# Altium schematic sheet PA0960_IR_Dot_Projector_IR_Flood_LED.SchDoc: =project_title
size Tabloid; PageSetup: Record=PageOptions|CenterHorizontal=True|CenterVertical=True|PrintScale=0.73|XCorrection=1.00|YCorrection=1.00|PrintKind=0|BorderSize=5000000|LeftOffset=0|BottomOffset=0|Orientation=2|PaperLength=1000|PaperWidth=1000|Scale=100|PaperSource=7|PrintQuality=-4|MediaType=1|DitherType=10|PaperKind=A4|PrintScaleMode=1; CompanyName: Luxonis Holding; Organization: Luxonis Holding; Address1: 1925 Harmony Park Drive; Address2: Westminster, CO; Address3: 80234; Address4: United States; SheetNumber: 2; SheetTotal: 3
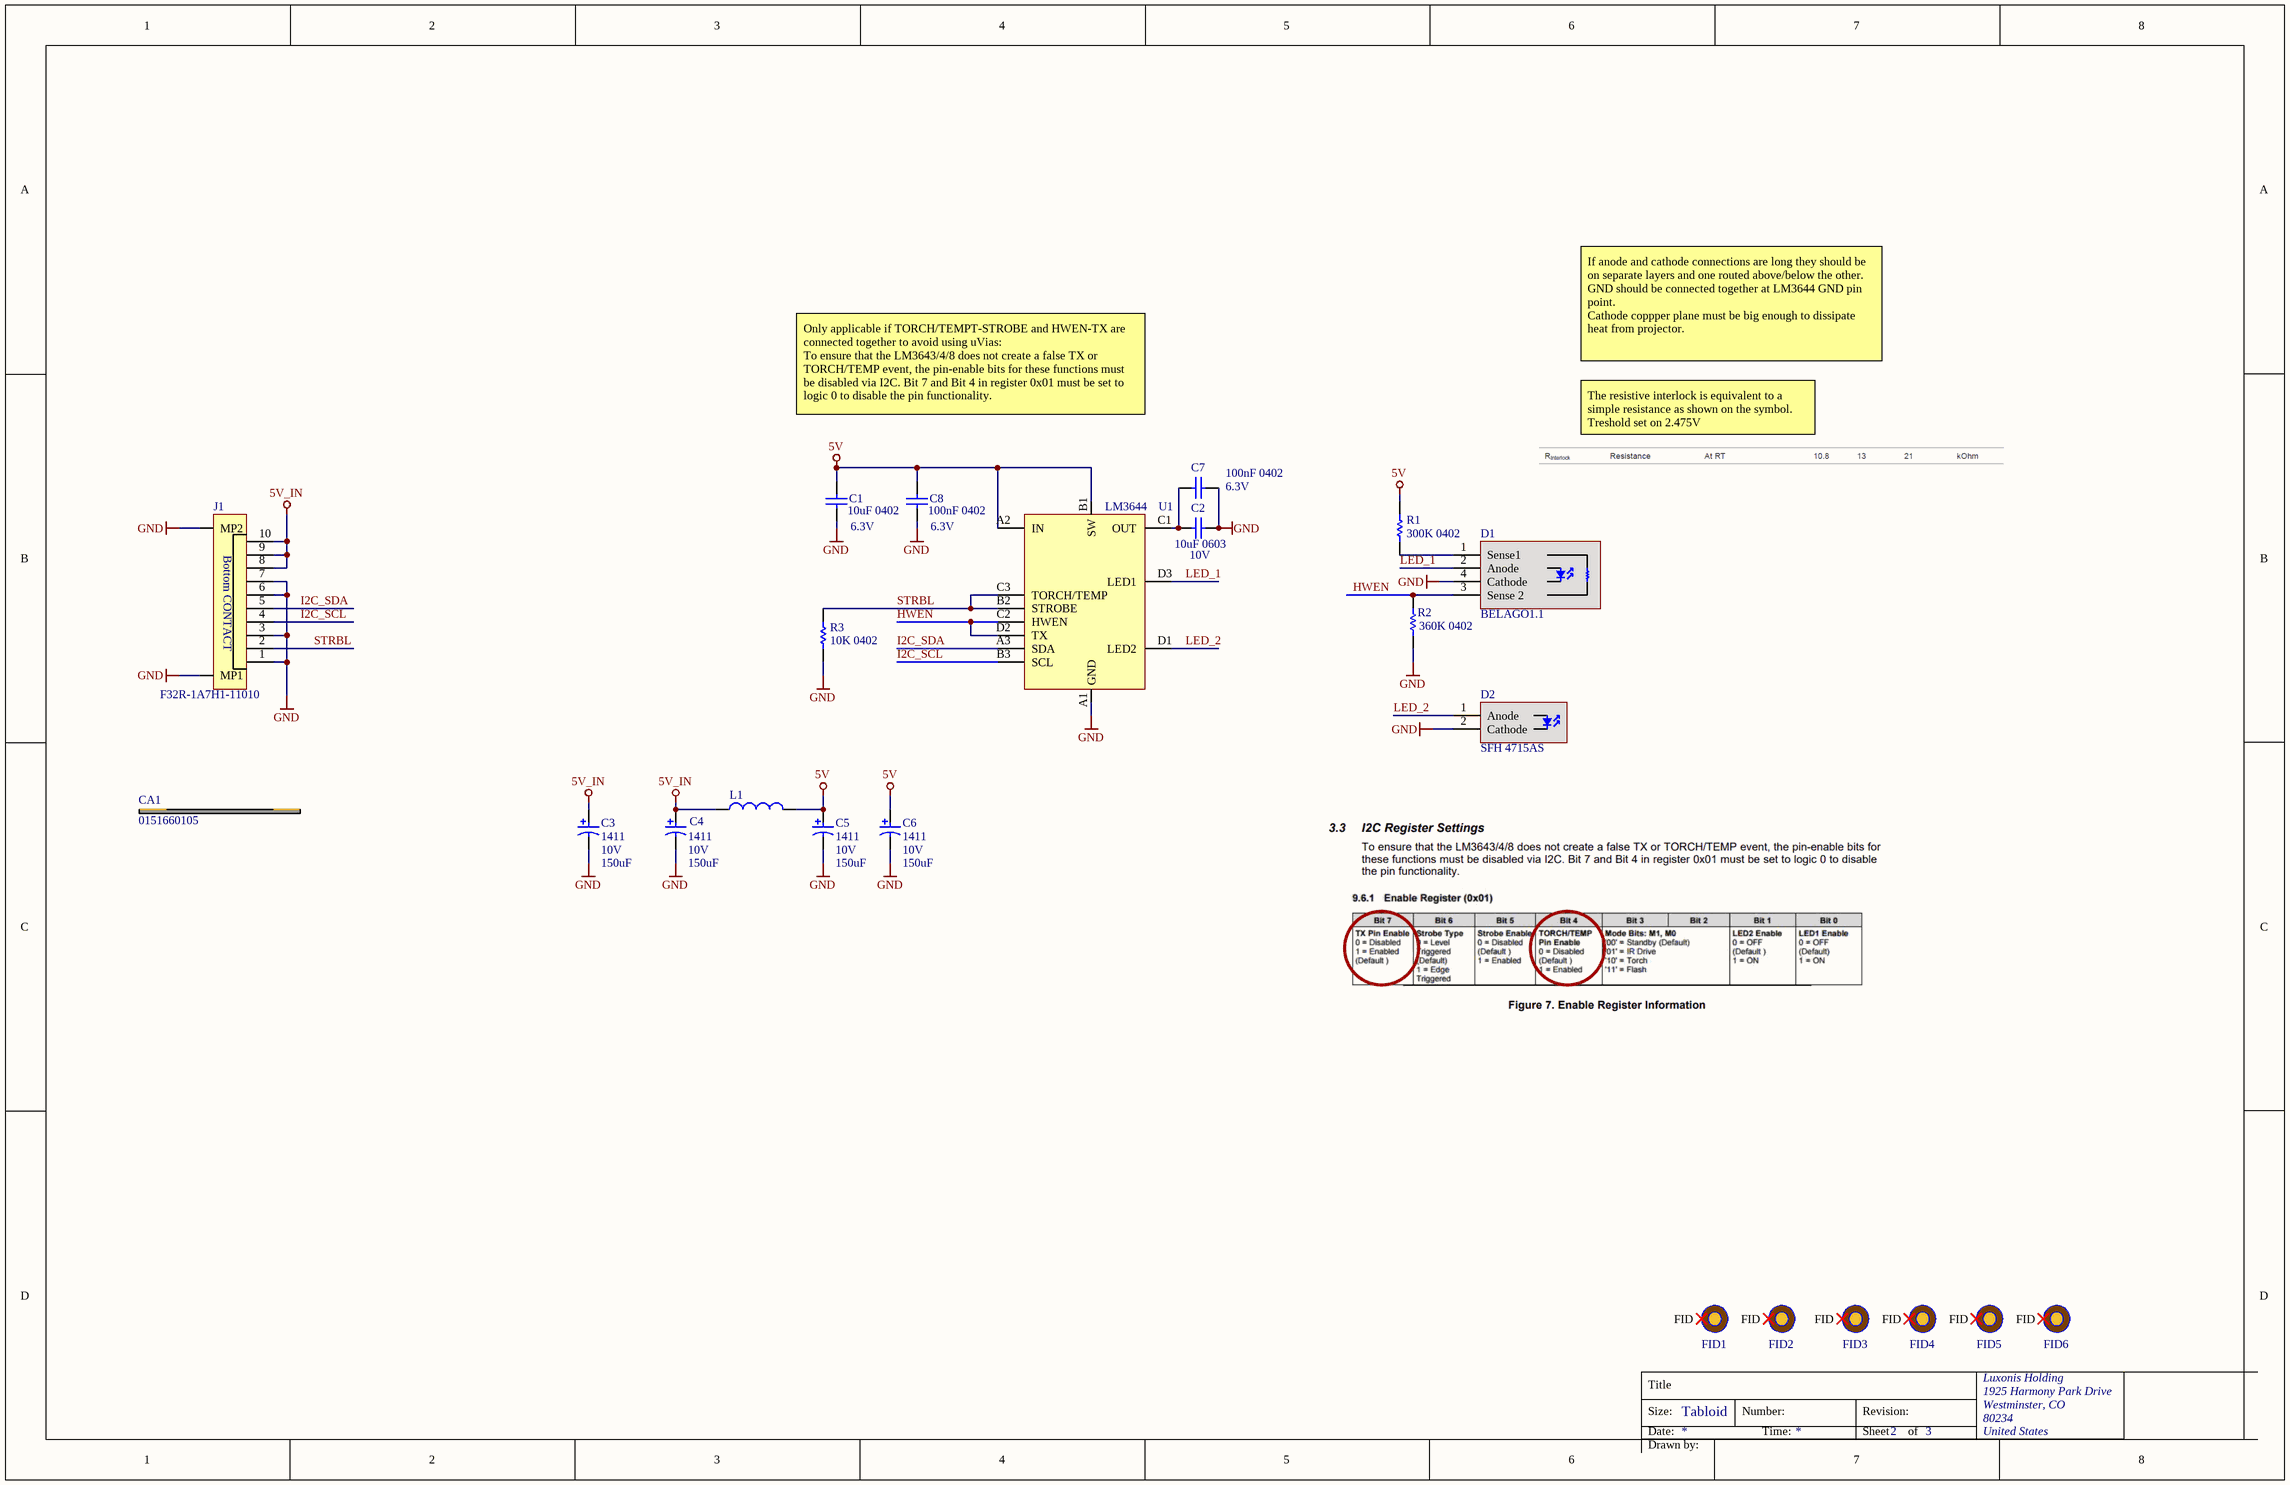
[diagram p0: PA0960_IR_Dot_Projector_IR_Flood_LED.SchDoc]

## Parts
C1  10uF 0402  Voltage Rating: 6.3V  [CAPC0402(1005)70_N]
C2  10uF 0603  Voltage Rating: 10V  [CAPC0603(1608)100_N]
C3  Size Code: 1411  Rated DC Voltage (URdc): 10V  Capacitance: 150uF  [RESTL1210(3225)_L]  (hidden comment: 150uF 1206 10V tantal)
C4  Size Code: 1411  Rated DC Voltage (URdc): 10V  Capacitance: 150uF  [RESTL1210(3225)_L]  (hidden comment: 150uF 1206 10V tantal)
C5  Size Code: 1411  Rated DC Voltage (URdc): 10V  Capacitance: 150uF  [RESTL1210(3225)_L]  (hidden comment: 150uF 1206 10V tantal)
C6  Size Code: 1411  Rated DC Voltage (URdc): 10V  Capacitance: 150uF  [RESTL1210(3225)_L]  (hidden comment: 150uF 1206 10V tantal)
C7  100nF 0402  Voltage Rating: 6.3V  [CAPC0402(1005)70_N]
C8  100nF 0402  Voltage Rating: 6.3V  [CAPC0402(1005)70_N]
CA1  0151660105
D1  BELAGO1.1  [Belago1.1]
D2  SFH 4715AS  [SFH 4715AS]
FID1  FIDUCIAL_ROUND_1MM  [FIDUCIAL_ROUND_1MM]  (value not drawn)  (no BOM)
FID2  FIDUCIAL_ROUND_1MM  [FIDUCIAL_ROUND_1MM]  (value not drawn)  (no BOM)
FID3  FIDUCIAL_ROUND_1MM  [FIDUCIAL_ROUND_1MM]  (value not drawn)  (no BOM)
FID4  FIDUCIAL_ROUND_1MM  [FIDUCIAL_ROUND_1MM]  (value not drawn)  (no BOM)
FID5  FIDUCIAL_ROUND_1MM  [FIDUCIAL_ROUND_1MM]  (value not drawn)  (no BOM)
FID6  FIDUCIAL_ROUND_1MM  [FIDUCIAL_ROUND_1MM]  (value not drawn)  (no BOM)
J1  F32R-1A7H1-11010  [F32R-1A7H1-11010]
L1  742792011  [SMD-0805]  (value not drawn)
R1  300K 0402  [RESC0402(1005)_L]
R2  360K 0402  [RESC0402(1005)_N]
R3  10K 0402  [RESC0402(1005)_L]
U1  LM3644  [LM3644YFFR]

## Nets
5V: C1.2 C5.1 C6.1 C8.2 L1.2 R1.2 U1.A2(IN) U1.B1(SW)
5V_IN: C3.1 C4.1 J1.8 J1.9 J1.10 L1.1
GND: C1.1 C2.2 C3.2 C4.2 C5.2 C6.2 C7.1 C8.1 D1.4(Cathode) D2.2(Cathode) J1.1 J1.3 J1.6 J1.7 J1.MP1 J1.MP2 R2.1 R3.1 U1.A1(GND)
HWEN: D1.3(Sense_2) R2.2 U1.C2(HWEN) U1.D2(TX)
I2C_SCL: J1.4 U1.B3(SCL)
I2C_SDA: J1.5 U1.A3(SDA)
LED_1: D1.2(Anode) U1.D3(LED1)
LED_2: D2.1(Anode) U1.D1(LED2)
STRBL: J1.2 R3.2 U1.B2(STROBE) U1.C3(TORCH/TEMP)
NetC2_1: C2.1 C7.2 U1.C1(OUT)
NetD1_1: D1.1(Sense1) R1.1

Not connected (* = marked no-connect by the designer): FID1 FID*; FID2 FID*; FID3 FID*; FID4 FID*; FID5 FID*; FID6 FID*

## Notes on the sheet
- If anode and cathode connections are long they should be on separate layers and one routed above/below the other.
  GND should be connected together at LM3644 GND pin point.
  Cathode coppper plane must be big enough to dissipate heat from projector.
- Only applicable if TORCH/TEMPT-STROBE and HWEN-TX are connected together to avoid using uVias:
  To ensure that the LM3643/4/8 does not create a false TX or TORCH/TEMP event, the pin-enable bits for these functions must be disabled via I2C. Bit 7 and Bit 4 in register 0x01 must be set to logic 0 to disable the pin functionality.
- The resistive interlock is equivalent to a simple resistance as shown on the symbol.
  Treshold set on 2.475V
- Title
- Size:
- Date:
- Tabloid
- Number:
- Time:
- Revision:
- Sheet
- of
- Drawn by:
- (in symbol CMP-002-00101-1) Bottom CONTACT

## Library data of the parts
C1 C7 C8 = CMP-004-000009-1: CAP CER 10UF 6.3V X5R 0402 20%; Manufacturer 1: Murata; Manufacturer Part Number 1: GRM155R60J106ME15D; Max Operating Temperature: 85°C; ComponentLink1Description: https://www.murata.com/~/media/webrenewal/support/library/catalog/products/capacitor/mlcc/c02e.ashx?la=en-us&src-supplier=Digi-Key; Design Item ID: GRM155R60J106ME15D; ComponentLink1URL: https://www.murata.com/~/media/webrenewal/support/library/catalog/products/capacitor/mlcc/c02e.ashx?la=en-us&src-supplier=Digi-Key; RoHS: Yes; Mount: Surface Mount; Stock 1: 1839627; Case Code (Imperial): 0402; Tolerance: 20%; Thickness: 0.026inch; Source: LuxonisMaster.SchLib; Dielectric: X5R; Width: 0.02inch; Capacitance: 10uF; Length: 0.039inch; Case Code (Metric): 1005; Case/Package: 0402; Packaging: Tape and Reel; Voltage Rating (DC): 6.3V; Pricing 1: 1=0.23000, 10=0.15700, 100=0.07950, 500=0.05442, 1000=0.04814, 2500=0.04605, 5000=0.04186 (USD); Min Operating Temperature: -55°C
C2 = CMP-004-000018-1: CAP CER 10UF 10V X5R 0603 20%; Manufacturer Part Number 1: GRM188R61A106ME69D; Manufacturer 1: Murata; Material: Ceramic; Packaging: Tape and Reel; ComponentLink6Description: http://www.farnell.com/datasheets/1872210.pdf?src-supplier=Newark; ComponentLink1URL: http://www.mouser.com/ds/2/281/c02e-2905.pdf?src-supplier=Mouser; ComponentLink5Description: http://search.murata.co.jp/Ceramy/image/img/A01X/G101/ENG/GRM188R61A106ME69-01.pdf?src-supplier=Digi-Key; Stock 1: 2873098; ComponentLink8Description: http://www.farnell.com/datasheets/2048014.pdf?src-supplier=Newark; Case/Package: 0603; Depth: 0.8mm; Termination: SMD/SMT; Weight: 0.000222oz; Mount: Surface Mount; ComponentLink4URL: http://www.farnell.com/datasheets/1872210.pdf?src-supplier=Farnell; ComponentLink1Description: http://www.mouser.com/ds/2/281/c02e-2905.pdf?src-supplier=Mouser; Voltage Rating (DC): 10V; ComponentLink7URL: http://www.farnell.com/datasheets/2048014.pdf?src-supplier=Element14; ComponentLink8URL: http://www.farnell.com/datasheets/2048014.pdf?src-supplier=Newark; Tolerance: 20%; REACH SVHC: Unknown; ComponentLink5URL: http://search.murata.co.jp/Ceramy/image/img/A01X/G101/ENG/GRM188R61A106ME69-01.pdf?src-supplier=Digi-Key; Length: 1.6mm; Case Code (Imperial): 0603; Min Operating Temperature: -55°C; Max Operating Temperature: 85°C; Dielectric: X5R; Case Code (Metric): 1608; ComponentLink3Description: http://www.farnell.com/datasheets/2048014.pdf?src-supplier=Farnell; Width: 0.8mm; ComponentLink2URL: http://components.arrow.com/part/dataview/0323_06119472?src-supplier=Arrow+Europe; ComponentLink7Description: http://www.farnell.com/datasheets/2048014.pdf?src-supplier=Element14; Height: 0.8mm; Lead Free: Lead Free; Design Item ID: GRM188R61A106ME69D; ComponentLink2Description: http://components.arrow.com/part/dataview/0323_06119472?src-supplier=Arrow+Europe; ComponentLink6URL: http://www.farnell.com/datasheets/1872210.pdf?src-supplier=Newark; ComponentLink3URL: http://www.farnell.com/datasheets/2048014.pdf?src-supplier=Farnell; Thickness: 0.035inch; ComponentLink4Description: http://www.farnell.com/datasheets/1872210.pdf?src-supplier=Farnell; Capacitance: 10uF; Pricing 1: 1=0.21000, 10=0.14100, 100=0.07130, 500=0.04876, 1000=0.04313 (USD); Package Quantity: 4000; Source: LuxonisMaster.SchLib; RoHS: Yes
C3-C6 = CMP-050-000000-1: Tantalum Capacitor, Polarized, Tantalum (dry/solid), 10V, 20% +Tol, 20% -Tol, 150uF, Surface Mount, 1210; Manufacturer 1: Kyocera AVX; ESR (Equivalent Series Resistance): 500mR; Leakage Current: 15uA; Ripple Current: 371mA; Mount: Surface Mount; Category: Tantalum Capacitors; ComponentLink10URL: https://datasheet.ciiva.com/7773/1533257-7773834.pdf?src-supplier=Element14; ComponentLink1Description: https://datasheet.ciiva.com:443/pdfs/VipMasterIC/IC/AVXC/AVXC-S-A0008508048/AVXC-S-A0008508048-1.pdf?src-supplier=IHS+Markit; ComponentLink12Description: https://datasheet.ciiva.com/17339/tlj-17339422.pdf?src-supplier=Avnet+Europe; REACH SVHC: Yes; Min Operating Temperature: -55°C; RoHS: Yes; Packaging: Tape and Reel; ComponentLink12URL: https://datasheet.ciiva.com/17339/tlj-17339422.pdf?src-supplier=Avnet+Europe; Pricing 1: 1=0,74000, 10=0,54700, 50=0,43800, 100=0,37540, 500=0,29716, 1000=0,25024 (USD); ComponentLink1URL: https://datasheet.ciiva.com:443/pdfs/VipMasterIC/IC/AVXC/AVXC-S-A0008508048/AVXC-S-A0008508048-1.pdf?src-supplier=IHS+Markit; ComponentLink3URL: https://datasheet.ciiva.com/264/tlj-264787.pdf?src-supplier=Digi-Key; ComponentLink9URL: https://datasheet.ciiva.com/14606/70001364-14606409.pdf?src-supplier=Allied+Electronics; ComponentLink7URL: https://datasheet.ciiva.com/7773/1533257-7773833.pdf?src-supplier=Element14; Terminal Finish: Nickel; ComponentLink4URL: https://datasheet.ciiva.com/264/tlj-264788.pdf?src-supplier=Digi-Key; Positive Tolerance: 20%; Polarity: Polarized; Design Item ID: TLJB157M010R0500; ComponentLink8Description: https://datasheet.ciiva.com/14593/70001364-14593673.pdf?src-supplier=Allied+Electronics; ComponentLink6Description: https://datasheet.ciiva.com/28515/tlj-28515528.pdf?src-supplier=Element14; JESD-609 Code: e3; Pin Count: 2; Capacitor Type: Tantalum; ComponentLink4Description: https://datasheet.ciiva.com/264/tlj-264788.pdf?src-supplier=Digi-Key; Package Style: SMTMeter; ComponentLink2Description: https://datasheet.ciiva.com/264/tlj-264786.pdf?src-supplier=Digi-Key; Manufacturer Part Number 1: TLJB157M010R0500; Negative Tolerance: 20%; Package Shape: Rectangular; Stock 1: 10000; ComponentLink11URL: https://datasheet.ciiva.com/11229/tlj-11229389.pdf?src-supplier=Avnet; Source: DM9095_R3M2E4.SCHLIB; Dielectric Material: Tantalum; ComponentLink9Description: https://datasheet.ciiva.com/14606/70001364-14606409.pdf?src-supplier=Allied+Electronics; Max Operating Temperature: 125°C; Number of Pins: 2; ComponentLink5URL: https://datasheet.ciiva.com/46385/1910903-46385237.pdf?src-supplier=Element14; RoHS Compliant: Yes; Width: 2.8mm; ComponentLink7Description: https://datasheet.ciiva.com/7773/1533257-7773833.pdf?src-supplier=Element14; ComponentLink8URL: https://datasheet.ciiva.com/14593/70001364-14593673.pdf?src-supplier=Allied+Electronics; ComponentLink6URL: https://datasheet.ciiva.com/28515/tlj-28515528.pdf?src-supplier=Element14; Length: 3.5mm; Height: 1.9mm; ComponentLink5Description: https://datasheet.ciiva.com/46385/1910903-46385237.pdf?src-supplier=Element14; Component Type: Standard; ComponentLink2URL: https://datasheet.ciiva.com/264/tlj-264786.pdf?src-supplier=Digi-Key; ComponentLink11Description: https://datasheet.ciiva.com/11229/tlj-11229389.pdf?src-supplier=Avnet; Termination: J BEND; ComponentLink10Description: https://datasheet.ciiva.com/7773/1533257-7773834.pdf?src-supplier=Element14; ComponentLink3Description: https://datasheet.ciiva.com/264/tlj-264787.pdf?src-supplier=Digi-Key
CA1 = CMP-00008-1: CABLE FFC 10POS 0.50MM 6"; Manufacturer 1: Molex; Wire/Cable Type: Flat Flex; Number of Conductors: 10; Cable Pitch: 0.5mm; Pitch: 0.02inch; Number of Pins: 10; Design Item ID: 0151660105; Source: Components - 20.09.22 - 15.53.SchLib; Manufacturer Part Number 1: 0151660105; RoHS: Yes; Radiation Hardening: No; Length: 6inch
D1 = CMP-004-00032-1: Dot-Pattern Infrared Illuminator for 3D Stereoscopic / Imaging AQAA-20; Manufacturer 1: AMS; Manufacturer Part Number 1: Belago1.1 AQAA-20; Design Item ID: BELAGO1.1; Source: DM9098.SchLib
D2 = CMP-004-00033-1: OSLON Black Series (850 nm) - 80°; Manufacturer 1: Osram; Ordering code: Q65111A6857; Manufacturer Part Number 1: SFH 4715AS; Design Item ID: SFH 4715AS; Source: DM9098.SchLib
FID1-FID6 = CMP-011-000000-1: Fiducial with various available footprints; Source: LuxonisMaster.SchLib; Design Item ID: FIDUCIAL
J1 = CMP-002-00101-1: FPC/FFC Connector Socket 10 Position 0.5mm Bottom Contact Solder Right Angle Surface Mount T/R; Manufacturer 1: Amphenol ICC / FCI; Source: DD2090_4CAM_FFC_R3M1E2.SCHLIB; Stock 1: 35427; Manufacturer Part Number 1: F32R-1A7H1-11010; Pricing 1: 1=0,53000, 10=0,44300, 50=0,44300, 100=0,38000, 500=0,33100, 1000=0,27300, 2500=0,24800, 5000=0,24000, 10000=0,23700 (USD); ComponentLink1URL: https://cdn.amphenol-icc.com/media/wysiwyg/files/drawing/f32r-f32j.pdf; ComponentLink1Description: https://cdn.amphenol-icc.com/media/wysiwyg/files/drawing/f32r-f32j.pdf; Design Item ID: F32R-1A7H1-11010; Category: FFC / FPC; RoHS: No
L1 = CMP-006-00026-1: Ferrite Chip, 1 Function(s), 3A, 2 Pin(s); Manufacturer 1: Wurth electronic; DC Resistance-Max: 25mR; Current Rating: 3A; Max Operating Temperature: 125°C; Supplier 1: Digi-Key; Min Operating Temperature: -55°C; Supplier Part Number 1: 732-4635-2-ND; Manufacturer Part Number 1: 742792011; RoHS Compliant: Yes; Case Code: 0805
R1 R3 = CMP-115-000004-1: RES SMD 10K OHM 1% 0402 1/16W Chip Resistor, 0402 [1005 Metric], 10 kohm, RC Series, 50 V, Thick Film, 62.5 mW; Manufacturer 1: Yageo; Manufacturer Part Number 1: RC0402FR-1310KL; Resistance: 10kR; Working Voltage: 50V; Power Rating: 62.5mW; Temperature Coefficient: 100ppm/°C; REACH SVHC: No SVHC; Number of Terminations: 2; Contact Plating: Tin,Matte,Lead; Length: 1mm; ComponentLink6Description: https://datasheet.ciiva.com/7983/1018594-7983533.pdf?src-supplier=Element14; Military Standard: Not; RoHS: Yes; ComponentLink2URL: https://datasheet.ciiva.com/28386/pyu-rc0402-51-rohs-l-6-28386855.pdf?src-supplier=Avnet+Europe; ComponentLink5URL: https://datasheet.ciiva.com/5557/pyu-rc0402-51-rohs-l-6-r-5557997.pdf?src-supplier=Mouser; Case Code (Metric): 1005; Number of Pins: 2; Tolerance: 1%; ComponentLink5Description: https://datasheet.ciiva.com/5557/pyu-rc0402-51-rohs-l-6-r-5557997.pdf?src-supplier=Mouser; Voltage Rating (DC): 50V; ComponentLink4Description: https://datasheet.ciiva.com/8891/pyu-rc0402-51-rohs-l-6-8891339.pdf?src-supplier=Avnet; ComponentLink1URL: https://datasheet.ciiva.com/16940/pyu-rc0402-51-rohs-l-6-16940293.pdf?src-supplier=Avnet+Europe; ComponentLink1Description: https://datasheet.ciiva.com/16940/pyu-rc0402-51-rohs-l-6-16940293.pdf?src-supplier=Avnet+Europe; Max Operating Temperature: 155°C; Depth: 0.5mm; Radiation Hardening: No; Voltage Rating: 50V; Termination: SMD/SMT; ComponentLink6URL: https://datasheet.ciiva.com/7983/1018594-7983533.pdf?src-supplier=Element14; ComponentLink4URL: https://datasheet.ciiva.com/8891/pyu-rc0402-51-rohs-l-6-8891339.pdf?src-supplier=Avnet; Case/Package: 0402; ComponentLink2Description: https://datasheet.ciiva.com/28386/pyu-rc0402-51-rohs-l-6-28386855.pdf?src-supplier=Avnet+Europe; Composition: Thick Film; Design Item ID: RC0402FR-1310KL; ComponentLink3URL: https://datasheet.ciiva.com/16740/pyu-rc0402-51-rohs-l-6-r-16740602.pdf?src-supplier=Future+Electronics; Min Operating Temperature: -55°C; Source: BW2098POE_1.SCHLIB; Packaging: Tape and Reel; ComponentLink3Description: https://datasheet.ciiva.com/16740/pyu-rc0402-51-rohs-l-6-r-16740602.pdf?src-supplier=Future+Electronics; Pricing 1: 1=0.10000, 25=0.01200, 100=0.00400, 250=0.00400, 500=0.00300, 1000=0.00300 (USD); Stock 1: 62239; Lead Free: Lead Free; Case Code (Imperial): 0402
R2 = CMP-013-000051-2: Fixed Resistor, Metal Glaze/thick Film, 0.0625W, 360000ohm, 50V, 1% +/-Tol, 100ppm/Cel, Surface Mount, 0402; Manufacturer 1: Yageo; Manufacturer Part Number 1: RC0402FR-07360KL; Rated Power Dissipation (P): 62.5mW; Resistance: 360kR; Tolerance: 1%; RoHS Compliant: Yes; Number of Pins: 2; Category: Chip SMD Resistors; Design Item ID: RC0402FR-07360KL; Min Operating Temperature: -55°C; Max Operating Temperature: 155°C
U1 = CMP-006-000006-1: LED Driver, 2-Segment, PBGA12; Manufacturer 1: Texas Instruments; Multiplexed Display Capability: No; Data Input Mode: SERIAL; Package Body Material: Plastic; Min Supply Voltage: 2.5V; Number of Segments: 2; Supply Voltage-Nom: 3.6V; Number of Functions: 1; Max Supply Voltage: 5.5V; Interface IC Type: LED DISPLAY DRIVER; Category: LED Drivers; ComponentLink2URL: https://datasheet.ciiva.com/48475/lm3644-48475318.pdf?src-supplier=Avnet; Pricing 1: 1=0,64580, 10=0,63600, 25=0,62590, 100=0,61590, 250=0,60610, 500=0,59600, 1000=0,58600, 3000=0,35000, 30000=0,34520, 300000=0,31610, 1500000=0,29870, 3000000=0,29850 (USD); Peak Reflow Temperature (Cel): 260°C; Package Shape: Rectangular; Temperature Grade: INDUSTRIAL; Source: DM9098.SchLib; Moisture Sensitivity Level: 1; Stock 1: 2033; Surface Mount: Yes; RoHS Compliant: Yes; Package Style: GRID ARRAY, VERY THIN PROFILE, FINE PITCHMeter; Terminal Finish: Copper; REACH SVHC: Yes; JESD-609 Code: e1; Terminal Position: BOTTOM; Length: 1.66mm; Height - Seated (Max): 0.625mm; RoHS: Yes; Number of Pins: 12; Manufacturer Part Number 1: LM3644YFFR; Package Code: VFBGA; ComponentLink1URL: https://www.ti.com:443/lit/ds/symlink/lm3644.pdf?src-supplier=IHS+Markit; Width: 1.28mm; Min Operating Temperature: -40°C; ComponentLink1Description: https://www.ti.com:443/lit/ds/symlink/lm3644.pdf?src-supplier=IHS+Markit; Terminal Pitch: 0.4mm; ComponentLink2Description: https://datasheet.ciiva.com/48475/lm3644-48475318.pdf?src-supplier=Avnet; Terminal Form: Ball; Max Operating Temperature: 85°C; Design Item ID: LM3644